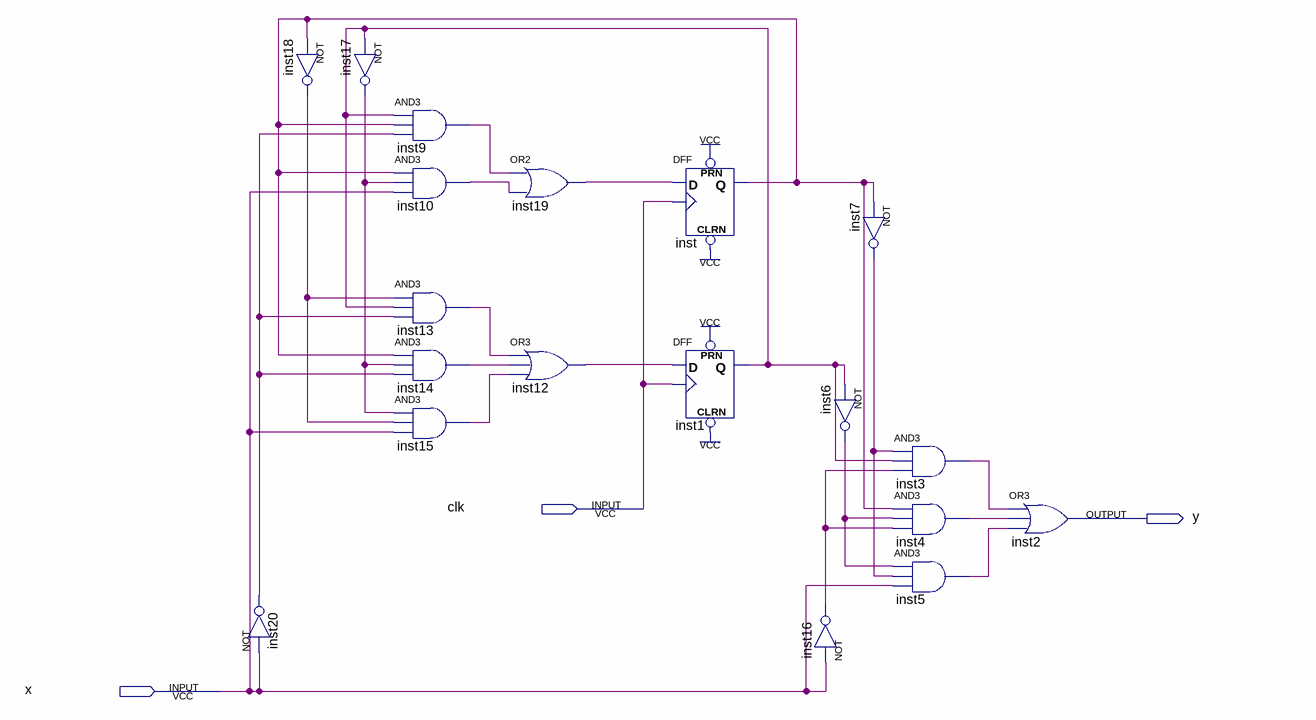
[diagram p0: schematic sheet]
// Quartus schematic 2sFSM.bdf as structural Verilog: 19 symbols, 3 pins
module \2sFSM  (
  input  clk,
  input  x,
  output y
);

  wire inst1_q, inst3_out, inst4_out, inst5_out, inst6_out, inst7_out, inst9_out, inst10_out, inst12_out,
       inst13_out, inst14_out, inst15_out, inst16_out, inst17_out, inst18_out, inst19_out, inst20_out, inst_q;

  not inst18 (inst18_out, inst_q);
  not inst20 (inst20_out, x);
  not inst17 (inst17_out, inst1_q);
  and inst9 (inst9_out, inst1_q, inst_q, inst20_out);
  and inst10 (inst10_out, inst_q, inst17_out, x);
  and inst13 (inst13_out, inst18_out, inst1_q, inst20_out);
  and inst14 (inst14_out, inst_q, inst17_out, inst20_out);
  and inst15 (inst15_out, inst17_out, inst18_out, x);
  or inst19 (inst19_out, inst9_out, inst10_out);
  or inst12 (inst12_out, inst13_out, inst14_out, inst15_out);
  DFF inst (.CLRN(1'b1), .CLK(clk), .D(inst19_out), .PRN(1'b1), .Q(inst_q));
  DFF inst1 (.CLRN(1'b1), .CLK(clk), .D(inst12_out), .PRN(1'b1), .Q(inst1_q));
  not inst6 (inst6_out, inst1_q);
  not inst16 (inst16_out, x);
  not inst7 (inst7_out, inst_q);
  and inst3 (inst3_out, inst7_out, inst1_q, inst16_out);
  and inst4 (inst4_out, inst_q, inst6_out, inst16_out);
  and inst5 (inst5_out, inst6_out, inst7_out, x);
  or inst2 (y, inst3_out, inst4_out, inst5_out);
endmodule
